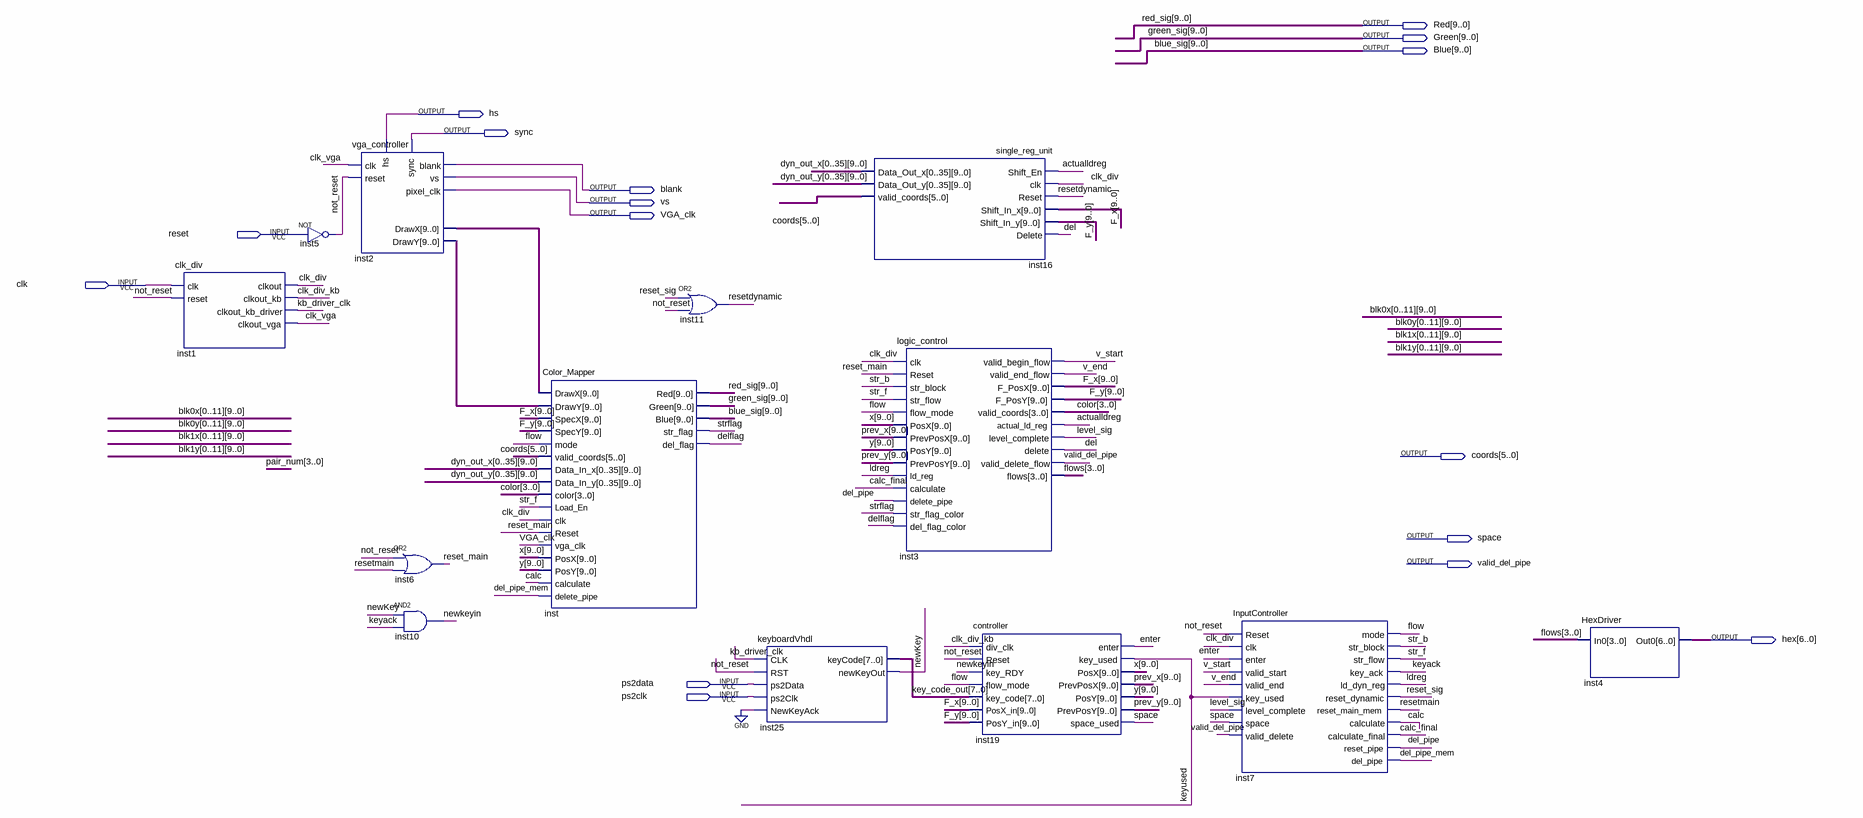
[diagram p0: schematic sheet]
// Quartus schematic Flow.bdf as structural Verilog: 13 symbols, 16 pins
module Flow (
  input  reset,
  input  clk,
  input  ps2data,
  input  ps2clk,
  output [9:0] Red,
  output [9:0] Green,
  output [9:0] Blue,
  output hs,
  output sync,
  output blank,
  output vs,
  output VGA_clk,
  output [5:0] coords,
  output space,
  output valid_del_pipe,
  output [6:0] hex
);

  wire actualldreg, calc, calc_final, clk_div, clk_div_kb, clk_vga, del, del_pipe, del_pipe_mem, delflag,
       enter, flow, kb_driver_clk, keyack, keyused, ldreg, level_sig, newKey, newkeyin, not_reset,
       reset_main, reset_sig, resetdynamic, resetmain, str_b, str_f, strflag, v_end, v_start;
  wire [3:0] color, flows;
  wire [7:0] key_code_out;
  wire [9:0] dyn_out_x_0, dyn_out_x_1, dyn_out_x_2, dyn_out_x_3, dyn_out_x_4, dyn_out_x_5, dyn_out_x_6,
       dyn_out_x_7, dyn_out_x_8, dyn_out_x_9, dyn_out_x_10, dyn_out_x_11, dyn_out_x_12, dyn_out_x_13,
       dyn_out_x_14, dyn_out_x_15, dyn_out_x_16, dyn_out_x_17, dyn_out_x_18, dyn_out_x_19, dyn_out_x_20,
       dyn_out_x_21, dyn_out_x_22, dyn_out_x_23, dyn_out_x_24, dyn_out_x_25, dyn_out_x_26, dyn_out_x_27,
       dyn_out_x_28, dyn_out_x_29, dyn_out_x_30, dyn_out_x_31, dyn_out_x_32, dyn_out_x_33, dyn_out_x_34,
       dyn_out_x_35, dyn_out_y_0, dyn_out_y_1, dyn_out_y_2, dyn_out_y_3, dyn_out_y_4, dyn_out_y_5,
       dyn_out_y_6, dyn_out_y_7, dyn_out_y_8, dyn_out_y_9, dyn_out_y_10, dyn_out_y_11, dyn_out_y_12,
       dyn_out_y_13, dyn_out_y_14, dyn_out_y_15, dyn_out_y_16, dyn_out_y_17, dyn_out_y_18, dyn_out_y_19,
       dyn_out_y_20, dyn_out_y_21, dyn_out_y_22, dyn_out_y_23, dyn_out_y_24, dyn_out_y_25, dyn_out_y_26,
       dyn_out_y_27, dyn_out_y_28, dyn_out_y_29, dyn_out_y_30, dyn_out_y_31, dyn_out_y_32, dyn_out_y_33,
       dyn_out_y_34, dyn_out_y_35, F_x, F_y, inst2_drawx, inst2_drawy, prev_x, prev_y, x, y;

  clk_div inst1 (
    .clk(clk), .reset(not_reset), .clkout(clk_div), .clkout_kb(clk_div_kb), .clkout_kb_driver(kb_driver_clk),
    .clkout_vga(clk_vga));
  not inst5 (not_reset, reset);
  vga_controller inst2 (
    .clk(clk_vga), .reset(not_reset), .hs(hs), .vs(vs), .pixel_clk(VGA_clk), .blank(blank), .sync(sync),
    .DrawX(inst2_drawx), .DrawY(inst2_drawy));
  or inst6 (reset_main, not_reset, resetmain);
  and inst10 (newkeyin, newKey, keyack);
  Color_Mapper inst (
    .DrawX(inst2_drawx), .DrawY(inst2_drawy), .SpecX(F_x), .SpecY(F_y), .mode(flow), .valid_coords(coords),
    .Data_In_x({dyn_out_x_0, dyn_out_x_1, dyn_out_x_2, dyn_out_x_3, dyn_out_x_4, dyn_out_x_5, dyn_out_x_6, dyn_out_x_7, dyn_out_x_8, dyn_out_x_9, dyn_out_x_10, dyn_out_x_11, dyn_out_x_12, dyn_out_x_13, dyn_out_x_14, dyn_out_x_15, dyn_out_x_16, dyn_out_x_17, dyn_out_x_18, dyn_out_x_19, dyn_out_x_20, dyn_out_x_21, dyn_out_x_22, dyn_out_x_23, dyn_out_x_24, dyn_out_x_25, dyn_out_x_26, dyn_out_x_27, dyn_out_x_28, dyn_out_x_29, dyn_out_x_30, dyn_out_x_31, dyn_out_x_32, dyn_out_x_33, dyn_out_x_34, dyn_out_x_35}),
    .Data_In_y({dyn_out_y_0, dyn_out_y_1, dyn_out_y_2, dyn_out_y_3, dyn_out_y_4, dyn_out_y_5, dyn_out_y_6, dyn_out_y_7, dyn_out_y_8, dyn_out_y_9, dyn_out_y_10, dyn_out_y_11, dyn_out_y_12, dyn_out_y_13, dyn_out_y_14, dyn_out_y_15, dyn_out_y_16, dyn_out_y_17, dyn_out_y_18, dyn_out_y_19, dyn_out_y_20, dyn_out_y_21, dyn_out_y_22, dyn_out_y_23, dyn_out_y_24, dyn_out_y_25, dyn_out_y_26, dyn_out_y_27, dyn_out_y_28, dyn_out_y_29, dyn_out_y_30, dyn_out_y_31, dyn_out_y_32, dyn_out_y_33, dyn_out_y_34, dyn_out_y_35}),
    .color(color), .Load_En(str_f), .clk(clk_div), .Reset(reset_main), .vga_clk(VGA_clk), .PosX(x), .PosY(y),
    .calculate(calc), .delete_pipe(del_pipe_mem), .Red(Red), .Green(Green), .Blue(Blue), .str_flag(strflag),
    .del_flag(delflag));
  or inst11 (resetdynamic, reset_sig, not_reset);
  keyboardVhdl inst25 (
    .CLK(kb_driver_clk), .RST(not_reset), .ps2Data(ps2data), .ps2Clk(ps2clk), .NewKeyAck(1'b0),
    .keyCode(key_code_out), .newKeyOut(newKey));
  single_reg_unit inst16 (
    .Shift_En(actualldreg), .clk(clk_div), .Reset(resetdynamic), .Shift_In_x(F_x), .Shift_In_y(F_y),
    .Delete(del),
    .Data_Out_x({dyn_out_x_0, dyn_out_x_1, dyn_out_x_2, dyn_out_x_3, dyn_out_x_4, dyn_out_x_5, dyn_out_x_6, dyn_out_x_7, dyn_out_x_8, dyn_out_x_9, dyn_out_x_10, dyn_out_x_11, dyn_out_x_12, dyn_out_x_13, dyn_out_x_14, dyn_out_x_15, dyn_out_x_16, dyn_out_x_17, dyn_out_x_18, dyn_out_x_19, dyn_out_x_20, dyn_out_x_21, dyn_out_x_22, dyn_out_x_23, dyn_out_x_24, dyn_out_x_25, dyn_out_x_26, dyn_out_x_27, dyn_out_x_28, dyn_out_x_29, dyn_out_x_30, dyn_out_x_31, dyn_out_x_32, dyn_out_x_33, dyn_out_x_34, dyn_out_x_35}),
    .Data_Out_y({dyn_out_y_0, dyn_out_y_1, dyn_out_y_2, dyn_out_y_3, dyn_out_y_4, dyn_out_y_5, dyn_out_y_6, dyn_out_y_7, dyn_out_y_8, dyn_out_y_9, dyn_out_y_10, dyn_out_y_11, dyn_out_y_12, dyn_out_y_13, dyn_out_y_14, dyn_out_y_15, dyn_out_y_16, dyn_out_y_17, dyn_out_y_18, dyn_out_y_19, dyn_out_y_20, dyn_out_y_21, dyn_out_y_22, dyn_out_y_23, dyn_out_y_24, dyn_out_y_25, dyn_out_y_26, dyn_out_y_27, dyn_out_y_28, dyn_out_y_29, dyn_out_y_30, dyn_out_y_31, dyn_out_y_32, dyn_out_y_33, dyn_out_y_34, dyn_out_y_35}),
    .valid_coords(coords));
  logic_control inst3 (
    .clk(clk_div), .Reset(reset_main), .str_block(str_b), .str_flow(str_f), .flow_mode(flow), .PosX(x),
    .PrevPosX(prev_x), .PosY(y), .PrevPosY(prev_y), .ld_reg(ldreg), .calculate(calc_final),
    .delete_pipe(del_pipe), .str_flag_color(strflag), .del_flag_color(delflag), .valid_begin_flow(v_start),
    .valid_end_flow(v_end), .F_PosX(F_x), .F_PosY(F_y), .valid_coords(color), .actual_ld_reg(actualldreg),
    .level_complete(level_sig), .delete(del), .valid_delete_flow(valid_del_pipe), .flows(flows));
  controller inst19 (
    .div_clk(clk_div_kb), .Reset(not_reset), .key_RDY(newkeyin), .flow_mode(flow), .key_code(key_code_out),
    .PosX_in(F_x), .PosY_in(F_y), .enter(enter), .key_used(keyused), .PosX(x), .PrevPosX(prev_x), .PosY(y),
    .PrevPosY(prev_y), .space_used(space));
  InputController inst7 (
    .Reset(not_reset), .clk(clk_div), .enter(enter), .valid_start(v_start), .valid_end(v_end),
    .key_used(keyused), .level_complete(level_sig), .space(space), .valid_delete(valid_del_pipe),
    .mode(flow), .str_block(str_b), .str_flow(str_f), .key_ack(keyack), .ld_dyn_reg(ldreg),
    .reset_dynamic(reset_sig), .reset_main_mem(resetmain), .calculate(calc), .calculate_final(calc_final),
    .reset_pipe(del_pipe), .del_pipe(del_pipe_mem));
  HexDriver inst4 (.In0(flows), .Out0(hex));

  // Other names for the same wires on the sheet: blue_sig[9:0] = Blue; green_sig[9:0] = Green; red_sig[9:0] = Red
endmodule
